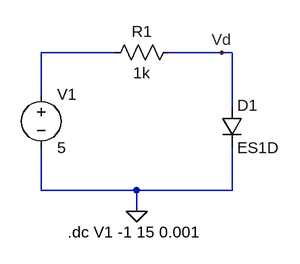
[diagram p0: schematic Problem01 (1).asc]
Problem01 (1).asc, the LTspice schematic file:
Version 4
SHEET 1 880 680
WIRE 96 64 -16 64
WIRE 256 64 176 64
WIRE 272 64 256 64
WIRE -16 128 -16 64
WIRE 272 144 272 64
WIRE -16 272 -16 208
WIRE 128 272 -16 272
WIRE 272 272 272 208
WIRE 272 272 128 272
WIRE 128 304 128 272
FLAG 128 304 0
FLAG 256 64 Vd
SYMBOL voltage -16 112 R0
WINDOW 123 0 0 Left 0
WINDOW 39 0 0 Left 0
SYMATTR InstName V1
SYMATTR Value 5
SYMBOL res 192 48 R90
WINDOW 0 0 56 VBottom 2
WINDOW 3 32 56 VTop 2
SYMATTR InstName R1
SYMATTR Value 1k
SYMBOL diode 256 144 R0
SYMATTR InstName D1
SYMATTR Value ES1D
TEXT 24 336 Left 2 !.dc V1 -1 15 0.001

The netlist it stands for:
* Problem01 (1).asc
V1 N001 0 5
R1 Vd N001 1k
D1 Vd 0 ES1D
.model D D
.lib standard.dio
.dc V1 -1 15 0.001
.backanno
.end